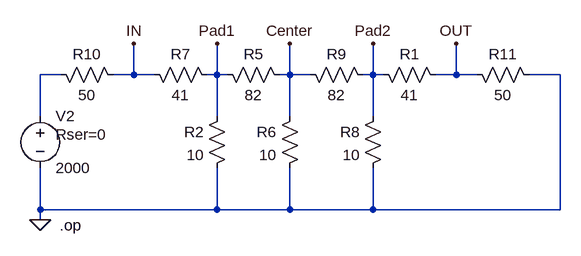
[diagram p0: schematic Draft1.asc]
Draft1.asc, the LTspice schematic file:
Version 4
SHEET 1 3164 932
WIRE -304 -1600 -336 -1600
WIRE -192 -1600 -192 -1648
WIRE -192 -1600 -224 -1600
WIRE -160 -1600 -192 -1600
WIRE -64 -1600 -64 -1648
WIRE -64 -1600 -80 -1600
WIRE -48 -1600 -64 -1600
WIRE 48 -1600 48 -1648
WIRE 48 -1600 32 -1600
WIRE 80 -1600 48 -1600
WIRE 176 -1600 176 -1648
WIRE 176 -1600 160 -1600
WIRE 192 -1600 176 -1600
WIRE 304 -1600 304 -1648
WIRE 304 -1600 272 -1600
WIRE 336 -1600 304 -1600
WIRE 464 -1600 416 -1600
WIRE -336 -1536 -336 -1600
WIRE -64 -1536 -64 -1600
WIRE 48 -1536 48 -1600
WIRE 176 -1536 176 -1600
WIRE -336 -1392 -336 -1456
WIRE -64 -1392 -64 -1456
WIRE -64 -1392 -336 -1392
WIRE 48 -1392 48 -1456
WIRE 48 -1392 -64 -1392
WIRE 176 -1392 176 -1456
WIRE 176 -1392 48 -1392
WIRE 464 -1392 464 -1600
WIRE 464 -1392 176 -1392
WIRE -336 -1376 -336 -1392
FLAG -336 -1376 0
FLAG -192 -1648 IN
FLAG 304 -1648 OUT
FLAG 48 -1648 Center
FLAG -64 -1648 Pad1
FLAG 176 -1648 Pad2
SYMBOL voltage -336 -1552 R0
WINDOW 123 0 0 Left 2
WINDOW 39 24 44 Left 2
SYMATTR SpiceLine Rser=0
SYMATTR InstName V2
SYMATTR Value 2000
SYMBOL res -48 -1552 M0
SYMATTR InstName R2
SYMATTR Value 10
SYMBOL res -64 -1584 M270
WINDOW 0 32 56 VTop 2
WINDOW 3 0 56 VBottom 2
SYMATTR InstName R7
SYMATTR Value 41
SYMBOL res -208 -1584 M270
WINDOW 0 32 56 VTop 2
WINDOW 3 0 56 VBottom 2
SYMATTR InstName R10
SYMATTR Value 50
SYMBOL res 432 -1584 M270
WINDOW 0 32 56 VTop 2
WINDOW 3 0 56 VBottom 2
SYMATTR InstName R11
SYMATTR Value 50
SYMBOL res 48 -1584 M270
WINDOW 0 32 56 VTop 2
WINDOW 3 0 56 VBottom 2
SYMATTR InstName R5
SYMATTR Value 82
SYMBOL res 64 -1552 M0
SYMATTR InstName R6
SYMATTR Value 10
SYMBOL res 192 -1552 M0
SYMATTR InstName R8
SYMATTR Value 10
SYMBOL res 176 -1584 M270
WINDOW 0 32 56 VTop 2
WINDOW 3 0 56 VBottom 2
SYMATTR InstName R9
SYMATTR Value 82
SYMBOL res 288 -1584 M270
WINDOW 0 32 56 VTop 2
WINDOW 3 0 56 VBottom 2
SYMATTR InstName R1
SYMATTR Value 41
TEXT -306 -1368 Left 2 !.op

The netlist it stands for:
* Draft1.asc
V2 N001 0 2000 Rser=0
R2 Pad1 0 10
R7 Pad1 IN 41
R10 IN N001 50
R11 0 OUT 50
R5 Center Pad1 82
R6 Center 0 10
R8 Pad2 0 10
R9 Pad2 Center 82
R1 OUT Pad2 41
.op
.backanno
.end